# EasyEDA Pro project ProPrj_OPA4377运放模块_2025-12-12.epro

# Schematic 逐飞OPA4377模块
Board Name: 逐飞OPA4377模块; Create Date: 2025-10-23; Page Name: Sheet_1; Project Name: OPA4377运放模块; Schematic Name: 逐飞OPA4377模块; Update Date: 2025-10-25; Add into BOM: yes; Convert to PCB: yes; Date: 2022-09-05; Draw By: MSSQY; REV: 1.0; Sheet: 1/1
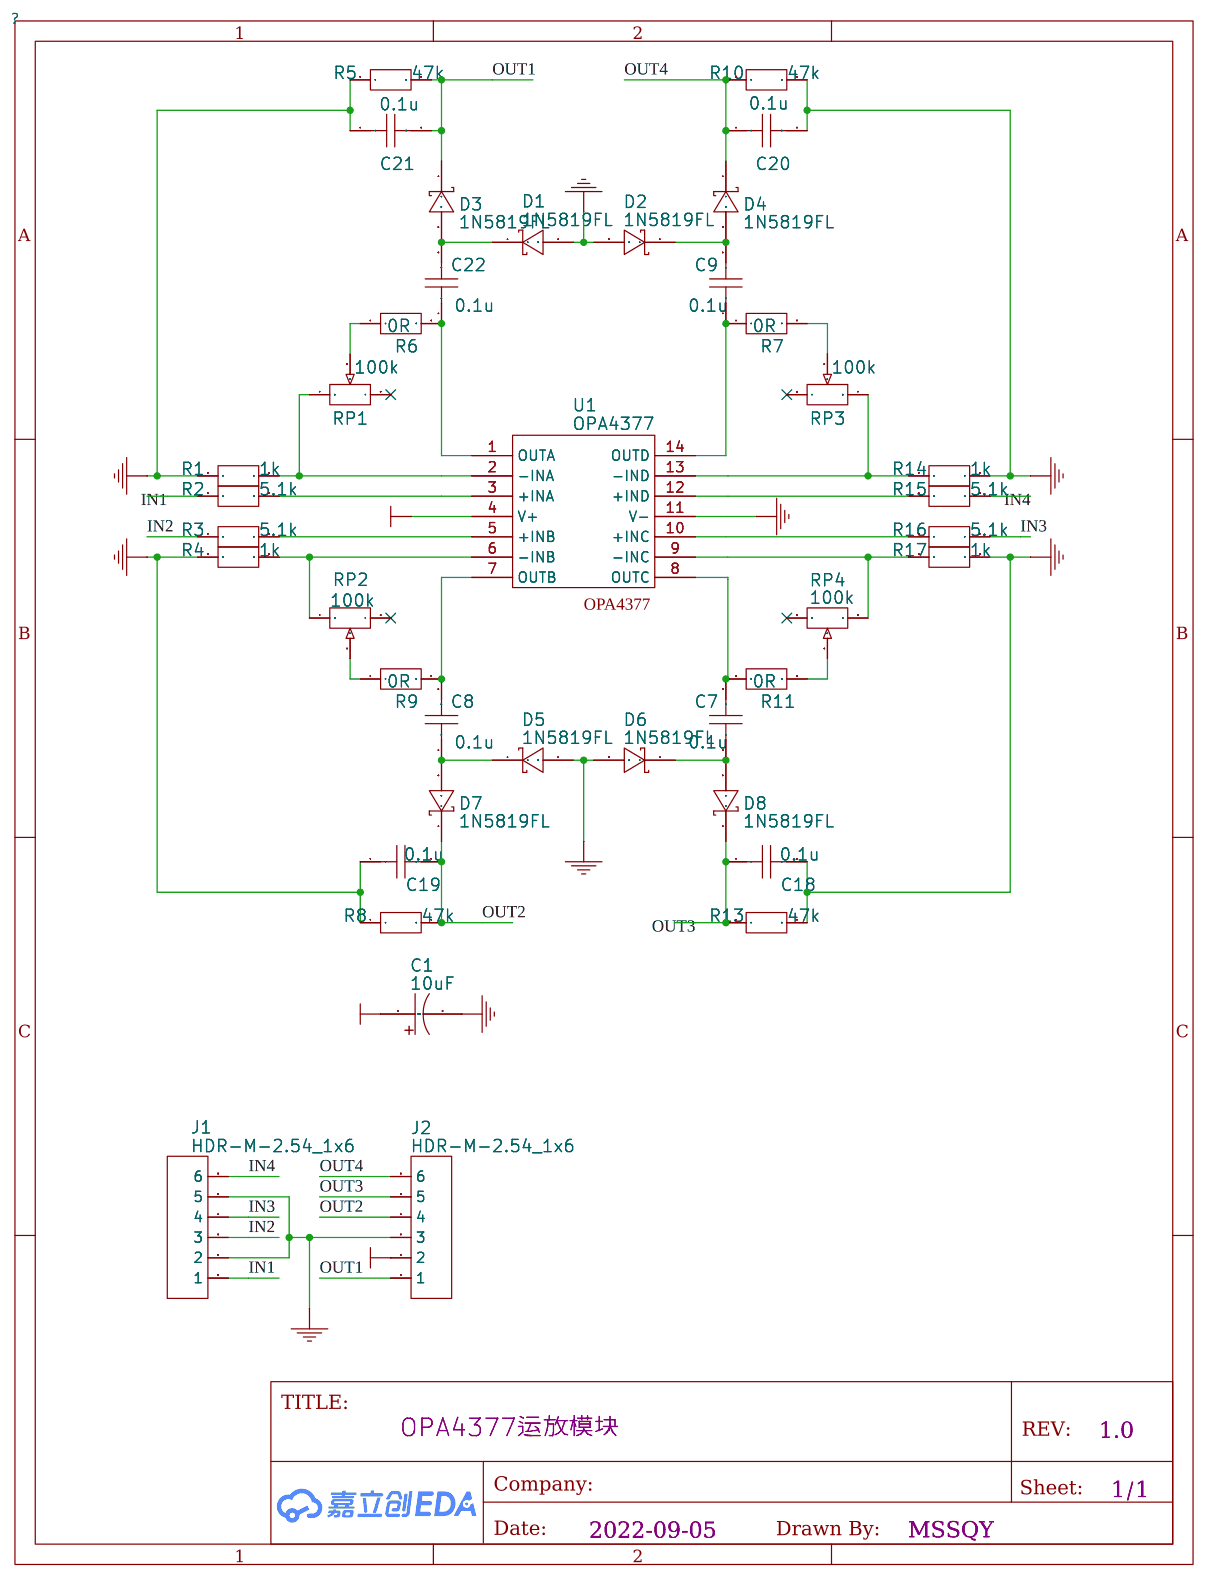
[diagram p0: schematic sheet]

## Parts
C1  10uF
C7  0.1u
C8  0.1u
C9  0.1u
C18  0.1u
C19  0.1u
C20  0.1u
C21  0.1u
C22  0.1u
D1  1N5819FL
D2  1N5819FL
D3  1N5819FL
D4  1N5819FL
D5  1N5819FL
D6  1N5819FL
D7  1N5819FL
D8  1N5819FL
J1  HDR-M-2.54_1x6
J2  HDR-M-2.54_1x6
R1  1k
R2  5.1k
R3  5.1k
R4  1k
R5  47k
R6  0R
R7  0R
R8  47k
R9  0R
R10  47k
R11  0R
R13  47k
R14  1k
R15  5.1k
R16  5.1k
R17  1k
RP1  100k
RP2  100k
RP3  100k
RP4  100k
U1  OPA4377

## Library data of the parts
C1 = CA45-A-10V-10μF-K: Supplier: LCSC; Supplier Part: C185772; Manufacturer: TORCH; JLCPCB Part Class: Extended Part
C7-C9 C18-C22 = MT18N101J500CT: Supplier Part: C323563; Supplier: LCSC; Manufacturer: Huaxin S&amp;T
D1-D8 = 1N5819FL: Supplier: LCSC; Supplier Part: C489143; Manufacturer: KEXIN; JLCPCB Part Class: Extended Part
J1 J2 = HDR-M-2.54_1x6: Supplier Part: C190819; Supplier: LCSC
R1 R4 R14 R17 = RT0603DRD071KL: Supplier Part: C165964; Supplier: LCSC; Manufacturer: YAGEO
R2 R3 R15 R16 = RS-03K5101FT: Supplier Part: C156350; Supplier: LCSC; Manufacturer: Guangdong Fenghua Advanced Tech
R5-R11 R13 = RS-03K473JT: Supplier Part: C115419; Supplier: LCSC; Manufacturer: FH
RP1-RP4 = -: Supplier Part: C132866; Supplier: LCSC; Value(Ω): 100K; Manufacturer: Nidec Copal Elec
U1 = OPA4377: Manufacturer: OPA4377AIPWR; Supplier: LCSC; Supplier Part: C130012

## Nets
GND: C1.2 C18.2 C19.1 C20.2 C21.1 D1.2 D2.2 D5.2 D6.2 J1.2 J1.5 J2.3 R1.1 R4.1 R5.1 R8.1 R10.2 R13.2 R14.2 R17.2 U1.11(V-)
VCC: C1.1 J2.2 U1.4(V+)
IN1: J1.1 R2.1
IN2: J1.3 R3.1
IN3: J1.4 R16.2
IN4: J1.6 R15.2
OUT1: C21.2 D3.1 J2.1 R5.2
OUT2: C19.2 D7.1 J2.4 R8.2
OUT3: C18.1 D8.1 J2.5 R13.1
OUT4: C20.1 D4.1 J2.6 R10.1
C7_1: C7.1 D6.1 D8.2
C7_2: C7.2 R11.1 U1.8(OUTC)
C8_1: C8.1 D5.1 D7.2
C8_2: C8.2 R9.2 U1.7(OUTB)
C9_1: C9.1 R7.1 U1.14(OUTD)
C9_2: C9.2 D2.1 D4.2
C22_1: C22.1 R6.2 U1.1(OUTA)
C22_2: C22.2 D1.1 D3.2
R2_2: R2.2 U1.3(+INA)
R3_2: R3.2 U1.5(+INB)
R4_2: R4.2 RP2.1(3) U1.6(-INB)
R14_1: R14.1 RP3.1(3) U1.13(-IND)
R15_1: R15.1 U1.12(+IND)
R16_1: R16.1 U1.10(+INC)
R17_1: R17.1 RP4.1 U1.9(-INC)
RP1_1: R1.2 RP1.1(3) U1.2(-INA)
RP1_2: R6.1 RP1.2
RP2_2: R9.1 RP2.2
RP3_2: R7.2 RP3.2
RP4_2: R11.2 RP4.2

Not connected (* = marked no-connect by the designer): RP1 3(1)*; RP2 3(1)*; RP3 3(1)*; RP4 3*

# Board PCB_PCB_逐飞OPA4377模块_2_2022-11-19
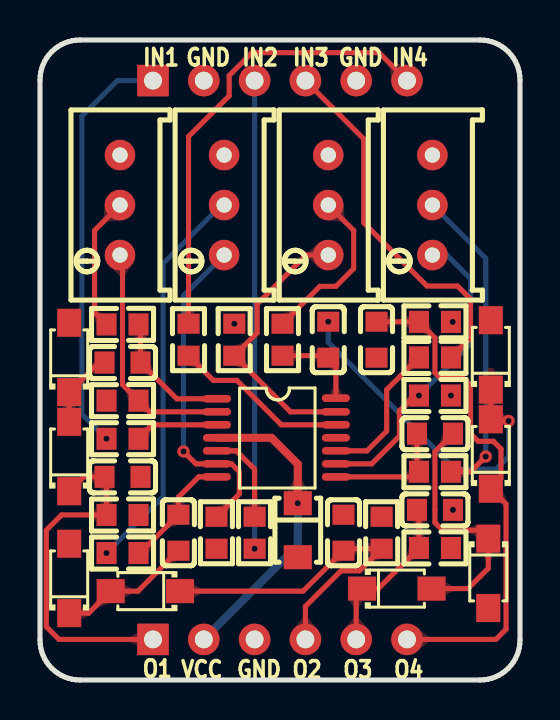
[diagram p1: board, top side]
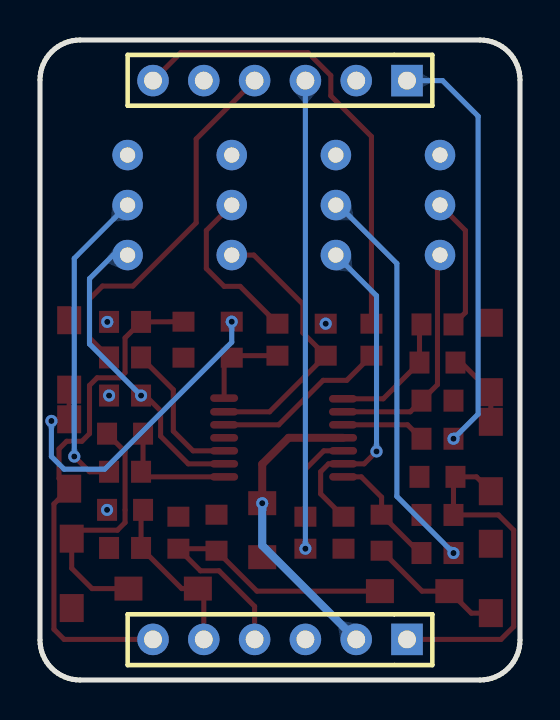
[diagram p2: board, bottom side, seen from below]

Outline 24 x 32 mm; copper layers: Top Layer, Bottom Layer. Coordinates in mm from the lower left corner of the outline.
Stack: Top Layer 0.035mm / Dielectric1 1.51mm FR4 er 4.5 / Bottom Layer 0.035mm

## Design rules (mm)
spacing Default (default): track to track 0.152, other pairs 0 to 0.152
track width Default (default): min 0.254, default 0.254, max 25.4
differential pair differentialPair (default): width min 0.127, default 0.254, max 2.54; gap min 0.152, default 0.152
via Default (default): diameter min 0.61, default 0.61, max 100.025; hole min 0.305, default 0.305, max 59.995
net GND uses gge6625

## Placement (name value [footprint] x y rotation side)
C1  10uF  [CAP-SMD_L3.2-W1.6]  12.89 7.49 270 top
C7  0.1u  [C0603]  19.75 12.32 180 top
C8  0.1u  [C0603]  6.92 7.36 90 top
C9  0.1u  [C0603]  14.41 17.02 90 top
C18  0.1u  [C0603]  19.75 8.51 0 top
C19  0.1u  [C0603]  15.18 7.36 270 top
C20  0.1u  [C0603]  16.83 17.02 270 top
C21  0.1u  [C0603]  4.13 10.16 180 top
C22  0.1u  [C0603]  4.13 15.87 180 top
D1  1N5819FL  [SOD-123FL_L2.7-W1.8-LS3.8-RD]  1.46 16.13 90 top
D2  1N5819FL  [SOD-123FL_L2.7-W1.8-LS3.8-RD]  22.54 16.25 90 top
D3  1N5819FL  [SOD-123FL_L2.7-W1.8-LS3.8-RD]  1.46 11.17 90 top
D4  1N5819FL  [SOD-123FL_L2.7-W1.8-LS3.8-RD]  22.54 11.3 90 top
D5  1N5819FL  [SOD-123FL_L2.7-W1.8-LS3.8-RD]  1.46 5.08 90 top
D6  1N5819FL  [SOD-123FL_L2.7-W1.8-LS3.8-RD]  22.41 5.33 270 top
D7  1N5819FL  [SOD-123FL_L2.7-W1.8-LS3.8-RD]  5.27 4.44 180 top
D8  1N5819FL  [SOD-123FL_L2.7-W1.8-LS3.8-RD]  17.84 4.57 0 top
J1  HDR-M-2.54_1x6  [HDR-M-2.54_1X6]  12 29.97 0 bottom
J2  HDR-M-2.54_1x6  [HDR-M-2.54_1X6]  12 2.03 0 bottom
R1  1k  [R0603]  4.13 13.97 0 top
R2  5.1k  [R0603]  4.13 12.06 0 top
R3  5.1k  [R0603]  10.73 7.36 90 top
R4  1k  [R0603]  8.82 7.36 90 top
R5  47k  [R0603]  4.13 8.25 180 top
R6  0R  [R0603]  4.13 17.78 0 top
R7  0R  [R0603]  12.13 17.02 90 top
R8  47k  [R0603]  17.08 7.36 270 top
R9  0R  [R0603]  4.13 6.35 0 top
R10  47k  [R0603]  19.75 17.91 0 top
R11  0R  [R0603]  19.75 10.41 0 top
R13  47k  [R0603]  19.75 6.6 0 top
R14  1k  [R0603]  9.71 17.02 90 top
R15  5.1k  [R0603]  7.43 17.02 90 top
R16  5.1k  [R0603]  19.75 16.13 0 top
R17  1k  [R0603]  19.75 14.22 0 top
RP1  100k  [RES-ADJ-TH_3P-L9.5-W4.85-P2.50-BL-BS]  4 23.75 180 top
RP2  100k  [RES-ADJ-TH_3P-L9.5-W4.85-P2.50-BL-BS]  9.21 23.75 180 top
RP3  100k  [RES-ADJ-TH_3P-L9.5-W4.85-P2.50-BL-BS]  14.41 23.75 180 top
RP4  100k  [RES-ADJ-TH_3P-L9.5-W4.85-P2.50-BL-BS]  19.62 23.75 180 top
U1  -  [OPA4377]  11.87 12.19 0 top
U2  逐飞OPA4377外框  [OPA4377四路运放]  12 16 0 bottom

## Footprints (pads in the part's own frame, mm; a bottom-side part is the same pattern mirrored in y, then rotated)
C0603
  rect 1x1.1 smd: 1(-0.9,0) 2(0.9,0)
CAP-SMD_L3.2-W1.6
  rect 1.2x1.4 smd: 1(-1.35,0) 2(1.35,0)
HDR-M-2.54_1X6
  rect 1.575x1.575 hole 0.889: 1(-6.35,0)
  round 1.575 hole 0.889: 2(-3.81,0) 3(-1.27,0) 4(1.27,0) 5(3.81,0) 6(6.35,0)
OPA4377
  oval 1.4x0.38 smd: 1(-3.021,1.871) 2(-3.022,1.22) 3(-3.025,0.57) 4(-3.026,-0.081) 5(-3.028,-0.732) 6(-3.03,-1.381) 7(-3.031,-2.032) 8(2.921,-2.032) 9(2.921,-1.381) 10(2.921,-0.732) 11(2.921,-0.081) 12(2.921,0.57) 13(2.921,1.22) 14(2.921,1.905)
R0603
  rect 1x1.1 smd: 1(-0.8,0) 2(0.8,0)
RES-ADJ-TH_3P-L9.5-W4.85-P2.50-BL-BS
  round 1.524 hole 0.762: 1(0,2.5) 2(0,0) 3(0,-2.5)
SOD-123FL_L2.7-W1.8-LS3.8-RD
  rect 1.4x1.2 smd: 1(-1.735,0) 2(1.735,0)

## Nets
As in the schematic.

Pads without a net: RP1 3; RP2 3; RP3 3; RP4 3

## Via types
v1: diameter 0.61, hole 0.305, Top Layer to Bottom Layer, 13 vias

## Routing (per net, layer and track width the routed paths; a pad name or vN(x,y) marks a point on that pad's centre or on a via; arc(x,y) is an arc through that point)
GND:
  vias: v1(9.71,17.82) v1(20.55,14.22) v1(20.64,17.91) v1(20.65,8.51)
VCC: length 15.3
  Top Layer w0.4: v1(12.89,8.84) 12.89,10.79 11.57,12.11 U1.4
  Bottom Layer w0.4: J2.2 12.89,6.73 v1(12.89,8.84)
C7_1: length 12.6
  Top Layer w0.254: D8.2 21.4,4.57 22.41,5.59 D6.1 21.99,7.49 20.13,7.49 19.75,7.87 19.75,11.42 C7.1
C7_2: length 6.2
  Top Layer w0.254: C7.2 18.85,10.51 R11.1 18.69,10.16 U1.8
C8_1: length 6.8
  Top Layer w0.254: C8.1 4.9,4.44 D7.2 2.43,3.34 D5.1
C8_2: length 6
  Top Layer w0.254: 8.84,10.16 7.94,10.16 6.92,9.14 6.92,8.26 5,6.35 R9.2
C9_1: length 4.5
  Top Layer w0.254: U1.14 14.79,15.74 C9.1 14.31,16.22 R7.1
C9_2: length 17.1
  Top Layer w0.254: D2.1 D4.2 23.35,13.04 v1(23.43,12.95)
  Bottom Layer w0.254: v1(23.43,12.95) 23.43,11.17 22.79,10.54 20.76,10.54 14.41,16.89 14.41,17.92
  vias: v1(14.41,17.92)
C22_1: length 6.5
  Top Layer w0.254: R6.2 5.03,17.68 5.03,15.87 6.84,14.06 8.85,14.06
C22_2: length 3.9
  Top Layer w0.254: D3.2 D1.1 2.94,15.87 C22.2
IN1: length 20.9
  Bottom Layer w0.254: v1(3.33,12.06) 2.09,13.3 2.09,28.19 3.87,29.97 J1.1
IN2: length 23.4
  Bottom Layer w0.254: v1(10.73,6.56) J1.3
IN3: length 18.6
  Top Layer w0.254: R16.2 21.53,17.11 21.53,19.05 20.88,19.7 19.35,19.7 16.19,22.86 16.19,27.05 J1.4
IN4: length 23.2
  Top Layer w0.254: J1.6 16.95,31.37 10.6,31.37 9.46,30.22 9.46,29.21 7.43,27.18 R15.2
OUT1: length 17.8
  Top Layer w0.254: J2.1 0.95,2.03 0.32,2.67 0.32,7.49 1.08,8.25 R5.2 3.33,10.06 C21.2 2.18,10.16 D3.1
OUT2: length 17.6
  Top Layer w0.254: 7,4.44 13.15,4.44 C19.2 15.27,6.56 R8.2 15.97,5.46 15.05,5.46 13.27,3.68 J2.4
OUT3: length 8.3
  Top Layer w0.254: J2.5 15.81,4.27 D8.1 16.91,4.57 R13.1 18.95,8.41 C18.1
OUT4: length 26
  Top Layer w0.254: 16.83,17.92 R10.1 19.75,17.11 19.75,15.37 20,15.11 21.14,15.11 21.53,14.73 21.53,12.32 21.91,11.94 22.67,11.94 23.05,11.56 23.05,10.07 D4.1 23.3,8.8 23.3,2.54 22.79,2.03 J2.6
R2_2: length 4.2
  Top Layer w0.254: R2.2 5.62,12.76 8.85,12.76
R3_2: length 4.6
  Top Layer w0.254: R3.2 10.73,10.54 9.81,11.46 U1.5
R4_2: length 16.6
  Top Layer w0.254: R4.2 9.97,9.31 9.97,10.41 9.57,10.81 U1.6 7.79,10.81 v1(7.17,11.43)
  Bottom Layer w0.254: RP2.1 7.17,19.22 v1(7.17,11.43)
R14_1: length 13.9
  Top Layer w0.254: U1.13 12.52,13.41 R14.1 10.86,17.36 10.86,18.79 13.31,21.25 RP3.1
R15_1: length 8.8
  Top Layer w0.254: R15.1 8.66,14.98 9.84,14.98 12.07,12.76 U1.12
R16_1: length 7.3
  Top Layer w0.254: U1.10 16.35,11.46 17.33,12.44 17.33,14.51 R16.1
R17_1: length 15.6
  Top Layer w0.254: v1(18.95,14.22) 18.73,14.22 17.97,13.46 17.97,12.19 16.59,10.81 U1.9
  Bottom Layer w0.254: v1(18.95,14.22) 21.53,16.8 21.53,20.06 20.34,21.25 RP4.1
RP1_1: length 11.8
  Top Layer w0.254: U1.2 5.48,13.41 R1.2 4.13,14.77 4.13,21.12 RP1.1
RP1_2: length 6.7
  Top Layer w0.254: R6.1 2.73,18.38 2.73,22.48 RP1.2
RP2_2: length 19.9
  Bottom Layer w0.254: v1(3.33,6.35) 6.16,9.18 6.16,20.83 9.08,23.75 RP2.2
RP3_2: length 8.4
  Top Layer w0.254: RP3.2 15.68,22.48 15.68,20.57 14.79,19.68 13.99,19.68 R7.2
RP4_2: length 15.7
  Top Layer w0.254: R11.2 21.53,10.41 v1(22.29,11.17)
  Bottom Layer w0.254: v1(22.29,11.17) 22.29,21.08 RP4.2

## Copper pours and planes (outline as drawn; the poured copper is in the pictures)
GND on Top Layer: -0.7,33.27 24.95,33.27 24.95,-0.38 -0.7,-0.38
GND on Bottom Layer: -0.57,33.91 24.7,33.91 24.7,-0.64 -0.57,-0.64

Small or netless copper shapes (teardrops, artwork), in the pictures only: 91 on Top Layer, 15 on Bottom Layer

## Text on the board
Top Silkscreen Layer: O1 | IN1 | VCC | GND | IN2 | O2 | IN3 | O3 | IN4 | O4
